# Altium schematic sheet diyagram.SchDoc
size A4; SheetNumber: 1; SheetTotal: 2
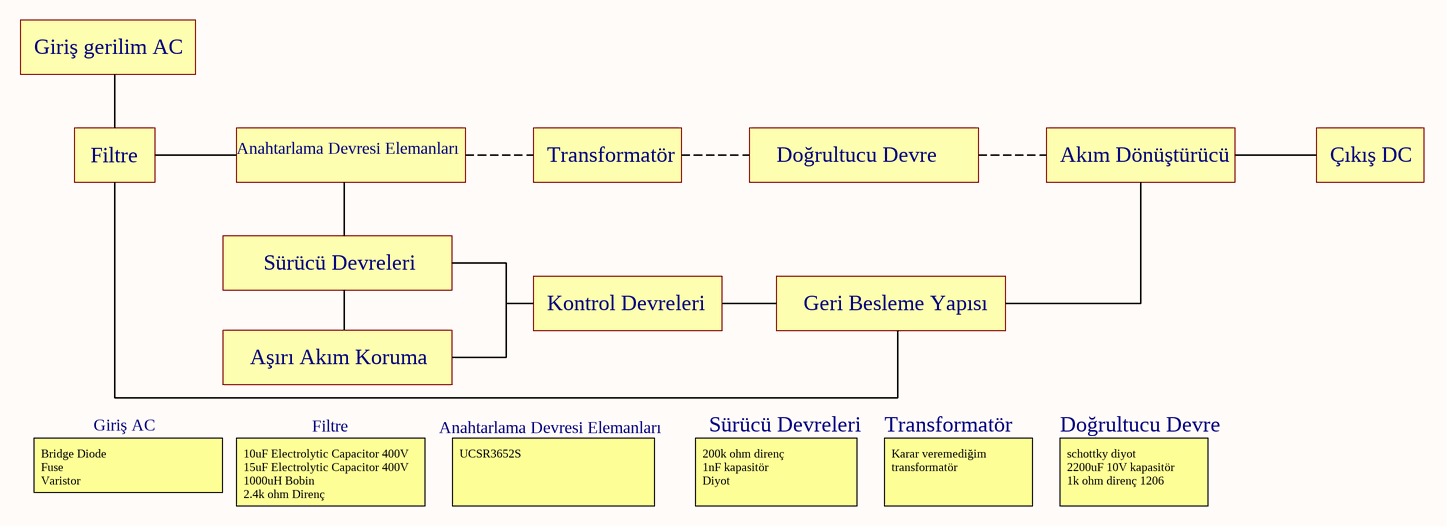
[diagram p0: diyagram.SchDoc]

## Notes on the sheet
- Giriş gerilim AC
- Filtre
- Anahtarlama Devresi Elemanları
- Transformatör
- Doğrultucu Devre
- Akım Dönüştürücü
- Çıkış DC
- Sürücü Devreleri
- Kontrol Devreleri
- Geri Besleme Yapısı
- Aşırı Akım Koruma
- Bridge Diode
  Fuse
  Varistor
- Giriş AC
- 10uF Electrolytic Capacitor 400V
  15uF Electrolytic Capacitor 400V
  1000uH Bobin
  2.4k ohm Direnç
- UCSR3652S
- 200k ohm direnç
  1nF kapasitör
  Diyot
- Karar veremediğim transformatör
- schottky diyot
  2200uF 10V kapasitör
  1k ohm direnç 1206